# Altium schematic sheet FPGA_PWRIN.SchDoc
size A4; SheetNumber: 2; SheetTotal: 8
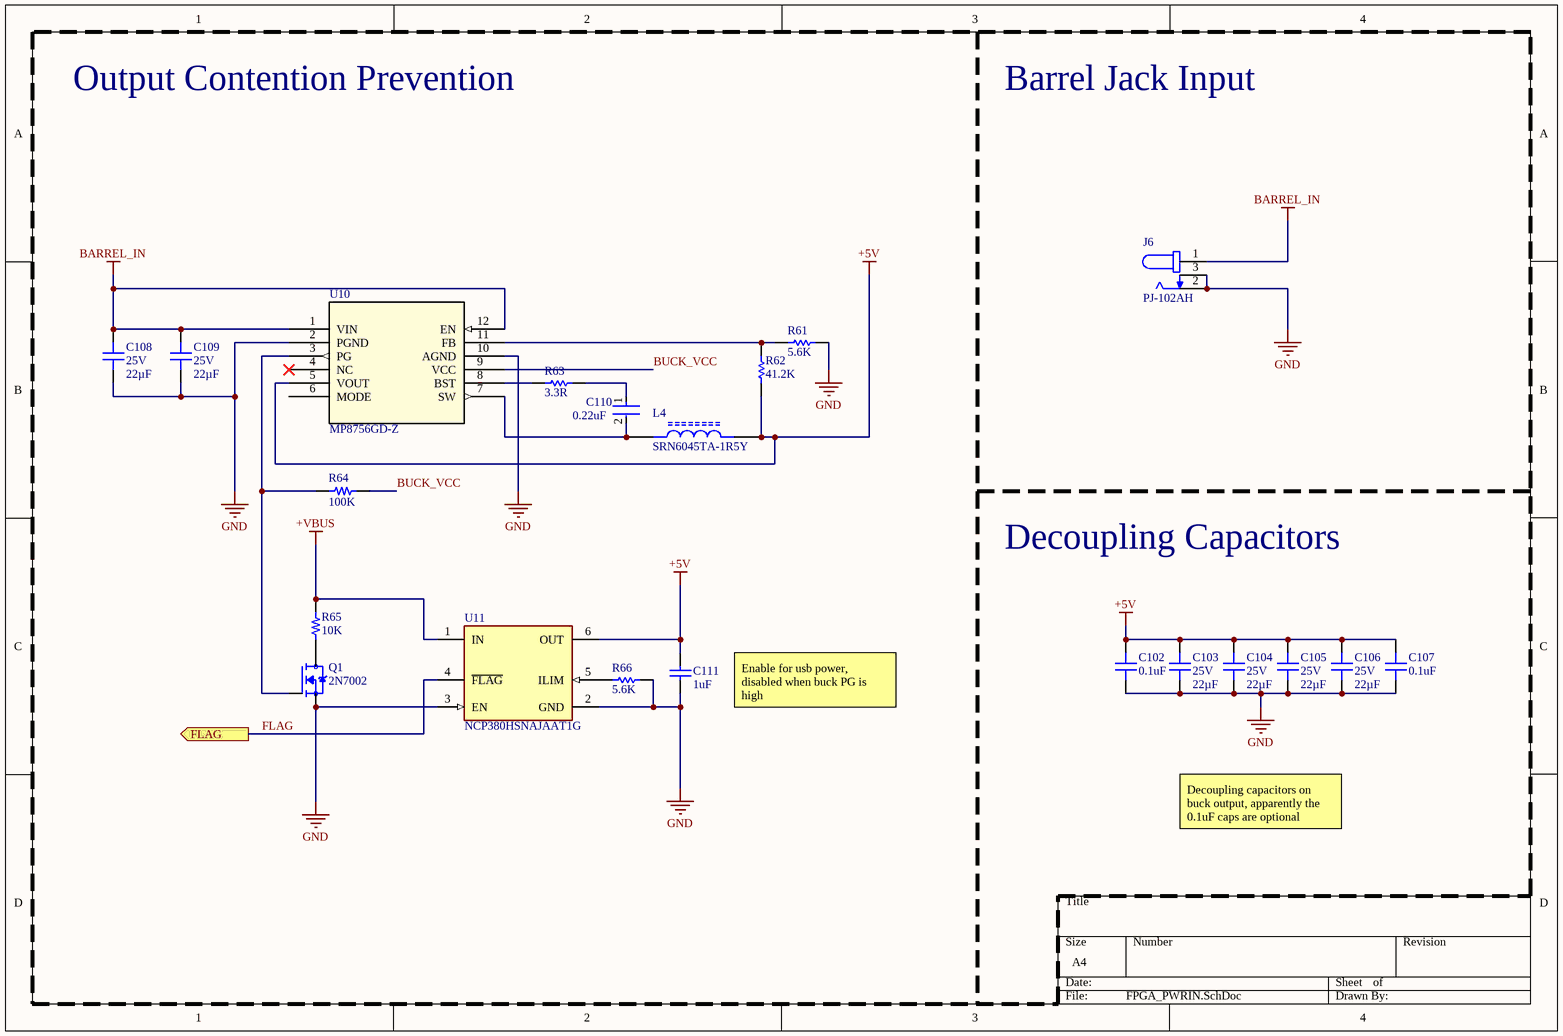
[diagram p0: FPGA_PWRIN.SchDoc]

## Parts
C102  Capacitance: 0.1uF  [CAP 0603_1608]  (hidden comment: CAP CER 0.1UF 100V 10% X7R 0603)
C103  Voltage Rating: 25V  Capacitance: 22µF  [CAP 0805_2012]  (hidden comment: CAP CER 22UF 25V X5R 0805)
C104  Voltage Rating: 25V  Capacitance: 22µF  [CAP 0805_2012]  (hidden comment: CAP CER 22UF 25V X5R 0805)
C105  Voltage Rating: 25V  Capacitance: 22µF  [CAP 0805_2012]  (hidden comment: CAP CER 22UF 25V X5R 0805)
C106  Voltage Rating: 25V  Capacitance: 22µF  [CAP 0805_2012]  (hidden comment: CAP CER 22UF 25V X5R 0805)
C107  Capacitance: 0.1uF  [CAP 0603_1608]  (hidden comment: CAP CER 0.1UF 100V 10% X7R 0603)
C108  Voltage Rating: 25V  Capacitance: 22µF  [CAP 0805_2012]  (hidden comment: CAP CER 22UF 25V X5R 0805)
C109  Voltage Rating: 25V  Capacitance: 22µF  [CAP 0805_2012]  (hidden comment: CAP CER 22UF 25V X5R 0805)
C110  0.22uF  [FP-GCM188-0_1-IPC_B]
C111  1uF  [CAPC1005X55X25LL05T10]
J6  PJ-102AH  [CUI_PJ-102AH]
L4  SRN6045TA-1R5Y  [IND_SRN6045TA-1R5Y]
Q1  2N7002  [SOT95P240X111-3N]
R61  5.6K  [RESC1608X55X25NL10T15]
R62  41.2K  [RESC1608X55X30LL20T20]
R63  3.3R  [RESC1608X55X25ML10T15]
R64  100K  [RES 0603_1608]
R65  10K  [RES 0603_1608]
R66  5.6K  [RESC1608X55X25NL10T15]
U10  MP8756GD-Z  [QFN-12_MP8756_MNP]
U11  NCP380HSNAJAAT1G  [FP-318G-02-MFG]

## Ports
FLAG (out)

## Nets
+5V: C102.1 C103.2 C104.2 C105.2 C106.2 C107.1 C111.2 L4.2 R62.1 U10.5(VOUT) U11.6(OUT)
+VBUS: R65.1 U11.1(IN)
BARREL_IN: C108.2 C109.2 J6.1 U10.1(VIN) U10.12(EN)
GND: C102.2 C103.1 C104.1 C105.1 C106.1 C107.2 C108.1 C109.1 C111.1 J6.2 J6.3 Q1.2(S) R61.1 R66.1 U10.2(PGND) U10.10(AGND) U11.2(GND) U11.3(EN)
BUCK_VCC: R64.2 U10.9(VCC)
FLAG: U11.4(~{FLAG}) ; port FLAG
NetC110_1: C110.1 R63.2
NetC110_2: C110.2 L4.1 U10.7(SW)
NetQ1_1: Q1.1(G) R64.1 U10.3(PG)
NetQ1_3: Q1.3(D) R65.2
NetR61_2: R61.2 R62.2 U10.11(FB)
NetR63_1: R63.1 U10.8(BST)
NetR66_2: R66.2 U11.5(ILIM)

Not connected (* = marked no-connect by the designer): U10 4(NC)* 6(MODE)

## Notes on the sheet
- Output Contention Prevention
- Barrel Jack Input
- Decoupling Capacitors
- Enable for usb power, disabled when buck PG is high
- Decoupling capacitors on buck output, apparently the 0.1uF caps are optional

## Library data of the parts
C102 C107 = CMP-013-0022-14: Ceramic Capacitor, Multilayer, Ceramic, 100V, 10% +Tol, 10% -Tol, X7R, 15% TC, 0.1uF, Surface Mount, 0603; Case/Package: 0603; Tolerance: 10%
C103-C106 C108 C109 = CMP-001-00143-1: 22 µF ±20% 25V Ceramic Capacitor X5R 0805 (2012 Metric); Tolerance: 20%; Case/Package: 0805
C110 = CMP-06035-005079-1: Ceramic Capacitor for Automotive 220nF  ±10% 25VDC X7R 0603 Paper T/R; Voltage Rating (DC): 25V; Lead Free: Lead Free; Case/Package: 0603; Case Code (Imperial): 0603; Radiation Hardening: No; Width: 0.8mm; Termination: SMD/SMT; Mount: Surface Mount; Min Operating Temperature: -55°C; Depth: 0.8mm; Voltage Rating: 25V; Ratings: AEC-Q200; Dielectric: X7R; Thickness: 0.035inch; Height: 0.8mm; Packaging: Tape and Reel; Length: 1.6mm; Case Code (Metric): 1608; Package Quantity: 10000; Tolerance: 10%; Capacitance: 220nF; Max Operating Temperature: 125°C
C111 = CMP-2008-03928-1: Manufacturer: Murata; Part Number: GRM155R71C104KA88J
J6 = PJ-102AH: 2.0 mm Center Pin, 5.0 A, Right Angle, Through Hole, Tapered Pins, Dc Power Jack Connector; Value: *; Availability: Unavailable; Price: None; Package: None; MP: PJ-102AH
L4 = SRN6045TA-1R5Y: Inductor Power Semi-Shielded Wirewound 220uH 20% 1MHz 15Q-Factor Ferrite 600mA 900mOhm DCR 2424 Automotive T/R; Package: None; Price: None; Value: *; MP: SRN6045TA-1R5Y; Availability: Unavailable
Q1 = 2N7002: N-Channel 60V 280mA (Ta) 350mW (Ta) Surface Mount SOT-23-3 (TO-236); MP: altium_native_batch; Package: None; Price: None; Availability: Unavailable; Value: *
R61 R66 = CMP-1012-00595-2: Chip Resistor, 5.6 KOhm, +/- 1%, 0.1 W, -55 to 155 degC, 0603 (1608 Metric), RoHS, Tape and Reel; Voltage Rating: 50 V; Case\Package: 0603; Power Rating: 100 mW; Type (Resistor): Thick Film; Resistance: 332 kohm; ComponentLink1Description: Manufacturer URL; Case Code (Metric): 1608; Height: 0.45 mm; Min Operating Temperature: -55 degC; RoHSCompliant: true; ComponentLink2URL: http://www.yageo.com/documents/recent/PYu-RC_Group_51_RoHS_L_04.pdf; Length: 1.6 mm; ComponentLink2Description: Datasheet; Width: 0.8 mm; PackageReference: 0603; DatasheetVersion: Rev. 4, 02/2016; Package Quantity: 5000; Tolerance: 1%; Case Code (Imperial): 0603; PackageDescription: 2-Pin Surface Mount Device, Body 1.6 x 0.8 mm; ComponentLink1URL: http://www.yageo.com/; Max Operating Temperature: 155 degC; Packaging: Tape and Reel
R62 = CMP-2000-00060-1: Manufacturer: Panasonic; Part Number: ERA3AEB4122V
R63 = CMP-2000-04272-1: Part Number: RC0603JR-073R3L; Manufacturer: Yageo
R64 = CMP-009-00182-12: 100 ±1% 0.1W, 1/10W Chip Resistor 0603 (1608 Metric) Automotive AEC-Q200 Thick Film; Temperature Coefficient: 100ppm/°C; Voltage Rating: 75V; Case/Package: 0603
R65 = CMP-009-00190-14: 10 ±1% 0.1W, 1/10W Chip Resistor 0603 (1608 Metric) Automotive AEC-Q200 Thick Film; Voltage Rating: 75V; Temperature Coefficient: 100ppm/°C; Case/Package: 0603
U10 = MP8756GD-Z: No Description Available; Mfr_Name: Monolithic Power Systems; RefDes: RefDes; Type: Type
U11 = CMP-07121-000002-1: IC PWR SWITCH P-CHAN 1:1 6TSOP; Manufacturer: ON Semiconductor; Number Of Outputs: 1; Output Current: 1A; Max Junction Temp: +125°C; Standoff Height: 0.01mm; Max Supply Voltage: 5.5V; Max Power Dissipation: 350mW; Min Supply Voltage: 2.5V; Device Class L3: unset; Lead Free: Yes; Temperature Range High: +125°C; Octopart: https://octopart.com/ncp380hsnajaat1g-on+semiconductor-19977073; Ambient Temperature Range High: +85°C; ComponentLink2URL: https://www.onsemi.cn/PowerSolutions/document/NCP380-D.PDF; Ipc Land Pattern Name: SOT95P275X100-6; Manufacturer Part Number: NCP380HSNAJAAT1G; Package: 318G-02; Digikey Description: IC PWR SWITCH P-CHAN 1:1 6TSOP; ComponentLink2Description: Datasheet; Ambient Temperature Range Low: -40°C; Footprint Url: https://www.onsemi.com/pub/Collateral/318G-02.PDF; Temperature Range Low: -40°C; Temperature: -40°C to +125°C; RoHS: TRUE; Device Class L2: Power Management ICs; Automotive: No; Device Class L1: Integrated Circuits (ICs); Category: IC; Mouser Description: Power Distribution Switch, Current-Limiting (Fixed and Adjustable) Adjustable, Enable H; Height: 1.1mm